# Altium schematic sheet Lights_Board_2.SchDoc: Lights 2
size Letter; Revision: 1.0; SheetNumber: 2; SheetTotal: 2; Website: www.uwmidsun.com; ProjectName: Lights Board
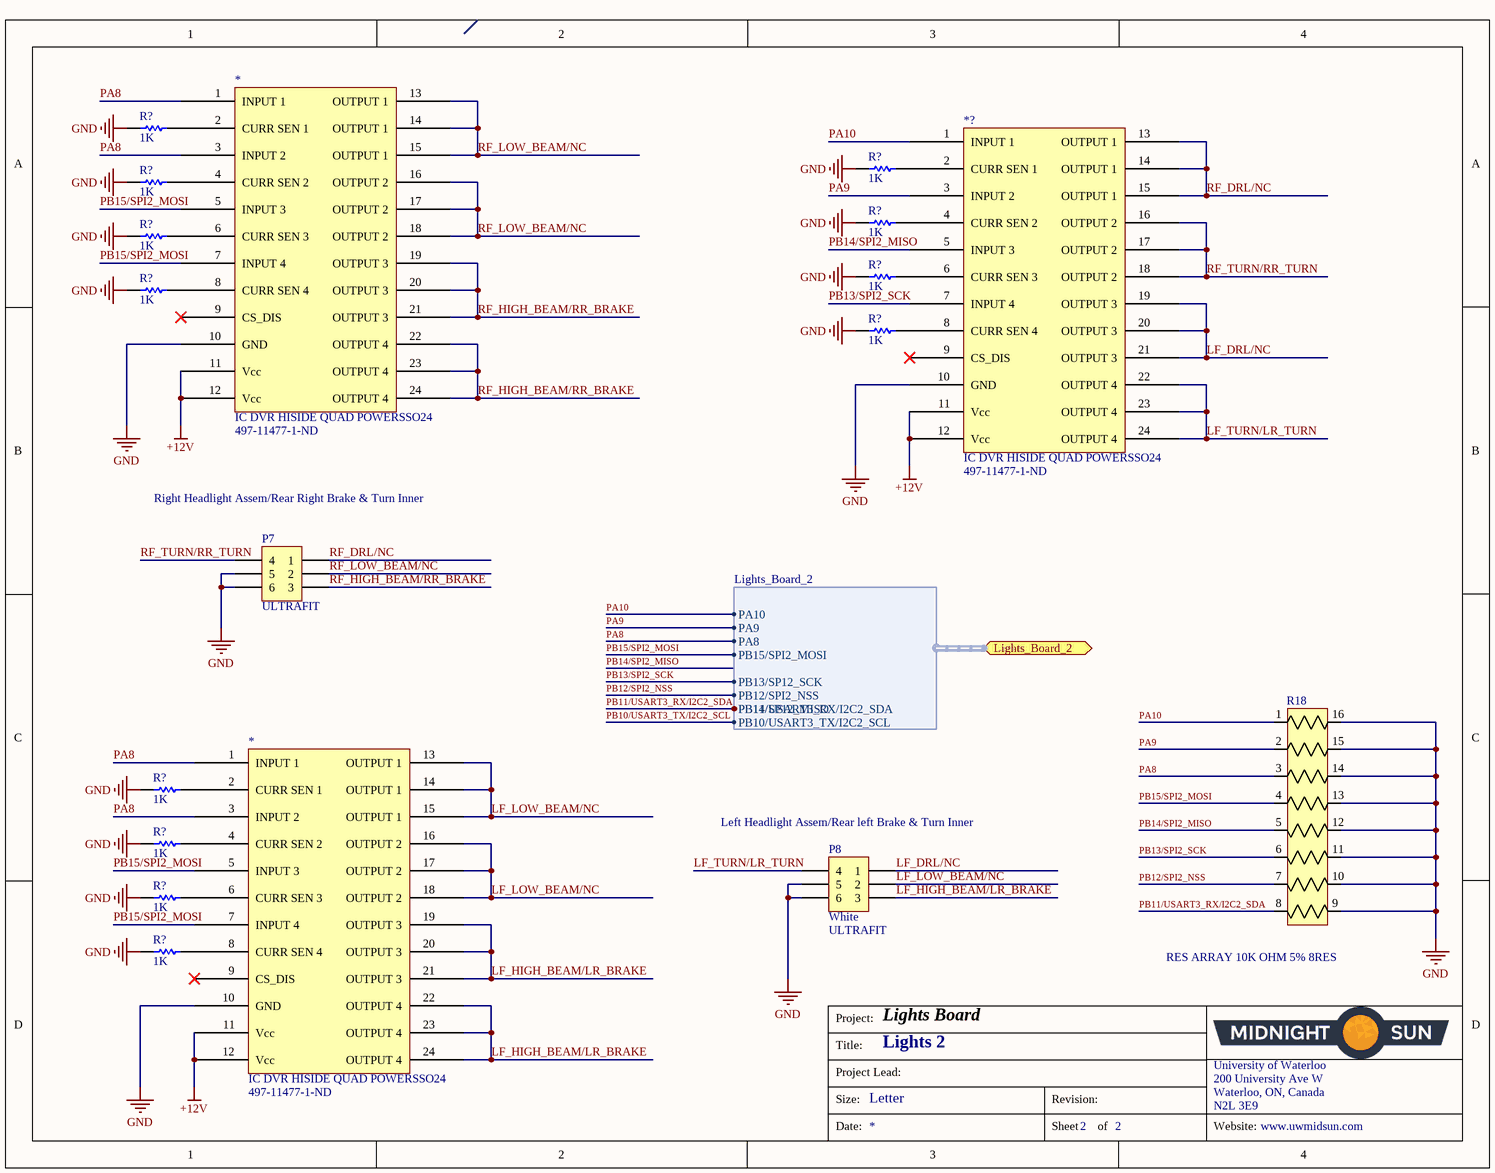
[diagram p0: Lights_Board_2.SchDoc]

## Parts
(Parts that share a designator on the sheet are numbered #1, #2 ... from top to bottom, then left to right.)
*#1  IC DVR HISIDE QUAD POWERSSO24  Supplier Part Number 1: 497-11477-1-ND  [IC DVR HISIDE QUAD POWERSSO24]
*#2  IC DVR HISIDE QUAD POWERSSO24  Supplier Part Number 1: 497-11477-1-ND  [IC DVR HISIDE QUAD POWERSSO24]
*?  IC DVR HISIDE QUAD POWERSSO24  Supplier Part Number 1: 497-11477-1-ND  [IC DVR HISIDE QUAD POWERSSO24]
P7  Series: ULTRAFIT  [CONN, 6POS ULTRA-FIT]  (hidden comment: CONN 6POS ULTRA-FIT 0.138")
P8  Insulation Color: White  Series: ULTRAFIT  [CONN, 6POS ULTRA-FIT - NATURAL COLOR]  (hidden comment: CONN 6POS ULTRA-FIT NATURAL COLOR 0.138")
R18  RES ARRAY 10K OHM 5% 8RES  [RES ARRAY, 8 POS 1506]
R?#1  1K  [RES, 0603]
R?#2  1K  [RES, 0603]
R?#3  1K  [RES, 0603]
R?#4  1K  [RES, 0603]
R?#5  1K  [RES, 0603]
R?#6  1K  [RES, 0603]
R?#7  1K  [RES, 0603]
R?#8  1K  [RES, 0603]
R?#9  1K  [RES, 0603]
R?#10  1K  [RES, 0603]
R?#11  1K  [RES, 0603]
R?#12  1K  [RES, 0603]

## Ports
Lights_Board_2 (harness Lights_Board_2)

## Harnesses
Lights_Board_2: PA10, PA9, PA8, PB15/SPI2_MOSI, PB14/SP12_MISO, PB13/SP12_SCK, PB12/SPI2_NSS, PB11/USART3_RX/I2C2_SDA, PB10/USART3_TX/I2C2_SCL

## Nets
+12V: *#1.11(Vcc) *#1.12(Vcc) *#2.11(Vcc) *#2.12(Vcc) *?.11(Vcc) *?.12(Vcc)
GND: *#1.10(GND) *#2.10(GND) *?.10(GND) P7.5 P7.6 P8.5 P8.6 R18.9 R18.10 R18.11 R18.12 R18.13 R18.14 R18.15 R18.16 R?#1.1 R?#2.1 R?#3.1 R?#4.1 R?#5.1 R?#6.1 R?#7.1 R?#8.1 R?#9.1 R?#10.1 R?#11.1 R?#12.1
LF_DRL/NC: *?.19(OUTPUT_3) *?.20(OUTPUT_3) *?.21(OUTPUT_3) P8.1
LF_HIGH_BEAM/LR_BRAKE: *#2.19(OUTPUT_3) *#2.20(OUTPUT_3) *#2.21(OUTPUT_3) *#2.22(OUTPUT_4) *#2.23(OUTPUT_4) *#2.24(OUTPUT_4) P8.3
LF_LOW_BEAM/NC: *#2.13(OUTPUT_1) *#2.14(OUTPUT_1) *#2.15(OUTPUT_1) *#2.16(OUTPUT_2) *#2.17(OUTPUT_2) *#2.18(OUTPUT_2) P8.2
LF_TURN/LR_TURN: *?.22(OUTPUT_4) *?.23(OUTPUT_4) *?.24(OUTPUT_4) P8.4
PA8: *#1.1(INPUT_1) *#1.3(INPUT_2) *#2.1(INPUT_1) *#2.3(INPUT_2) R18.3 ; port Lights_Board_2.PA8
PA9: *?.3(INPUT_2) R18.2 ; port Lights_Board_2.PA9
PA10: *?.1(INPUT_1) R18.1 ; port Lights_Board_2.PA10
PB10/USART3_TX/I2C2_SCL: port Lights_Board_2.PB10/USART3_TX/I2C2_SCL
PB11/USART3_RX/I2C2_SDA: R18.8 ; port Lights_Board_2.PB14/SP12_MISO, port Lights_Board_2.PB11/USART3_RX/I2C2_SDA
PB12/SPI2_NSS: R18.7 ; port Lights_Board_2.PB12/SPI2_NSS
PB13/SPI2_SCK: *?.7(INPUT_4) R18.6 ; port Lights_Board_2.PB13/SP12_SCK
PB14/SPI2_MISO: *?.5(INPUT_3) R18.5
PB15/SPI2_MOSI: *#1.5(INPUT_3) *#1.7(INPUT_4) *#2.5(INPUT_3) *#2.7(INPUT_4) R18.4 ; port Lights_Board_2.PB15/SPI2_MOSI
RF_DRL/NC: *?.13(OUTPUT_1) *?.14(OUTPUT_1) *?.15(OUTPUT_1) P7.1
RF_HIGH_BEAM/RR_BRAKE: *#1.19(OUTPUT_3) *#1.20(OUTPUT_3) *#1.21(OUTPUT_3) *#1.22(OUTPUT_4) *#1.23(OUTPUT_4) *#1.24(OUTPUT_4) P7.3
RF_LOW_BEAM/NC: *#1.13(OUTPUT_1) *#1.14(OUTPUT_1) *#1.15(OUTPUT_1) *#1.16(OUTPUT_2) *#1.17(OUTPUT_2) *#1.18(OUTPUT_2) P7.2
RF_TURN/RR_TURN: *?.16(OUTPUT_2) *?.17(OUTPUT_2) *?.18(OUTPUT_2) P7.4
Net*#1_2: *#1.2(CURR_SEN_1) R?#1.2
Net*#1_4: *#1.4(CURR_SEN_2) R?#3.2
Net*#1_6: *#1.6(CURR_SEN_3) R?#5.2
Net*#1_8: *#1.8(CURR_SEN_4) R?#7.2
Net*#2_2: *#2.2(CURR_SEN_1) R?#9.2
Net*#2_4: *#2.4(CURR_SEN_2) R?#10.2
Net*#2_6: *#2.6(CURR_SEN_3) R?#11.2
Net*#2_8: *#2.8(CURR_SEN_4) R?#12.2
Net*?_2: *?.2(CURR_SEN_1) R?#2.2
Net*?_4: *?.4(CURR_SEN_2) R?#4.2
Net*?_6: *?.6(CURR_SEN_3) R?#6.2
Net*?_8: *?.8(CURR_SEN_4) R?#8.2

Not connected (* = marked no-connect by the designer): *#1 9(CS_DIS)*; *#2 9(CS_DIS)*; *? 9(CS_DIS)*

## Notes on the sheet
- Right Headlight Assem/Rear Right Brake & Turn Inner
- (near P8) Left Headlight Assem/Rear left Brake & Turn Inner
- Project:
- Title:
- Size:
- Project Lead:
- Letter
- Revision:
- University of Waterloo
- 200 University Ave W
- Waterloo, ON, Canada
- N2L 3E9
- Date:
- Sheet
- of
- Website:

## Library data of the parts
*#1 *#2 *? = IC DVR HISIDE QUAD POWERSSO24: Manufacturer: STMicroelectronics; Manufacturer Part Number: VNQ5050AKTR-E; Switch Type: General Purpose; Number of Outputs: 4; Ratio - Input:Output: 1:1; Output Configuration: High Side; Output Type: N-Channel; Interface: On/Off; Voltage - Load: 4.5 V ~ 36 V; Voltage - Supply (Vcc/Vdd): Not Required; Current - Output (Max): 13.5A; Rds On (Typ): 50 mOhm (Max); Input Type: Non-Inverting; Fault Protection: Current Limiting (Fixed), Over Temperature, Over Voltage; Supplier 1: Digi-Key; RoHS: RoHS Compliant; Category: Integrated Circuits (ICs); Stock 1: 409; Pricing 1: 1=7.53, 10=6.765, 100=5.5429, 500=4.71858 (CAD); Packaging: Cut Tape (CT); Part Status: Active; Features: -; Operating Temperature: -40°C ~ 150°C (TJ); Package / Case: 24-SOP (0.295", 7.50mm Width) Exposed Pad; Supplier Device Package: PowerSSO-24; Base Part Number: VNQ5050; ComponentLink1URL: http://www.st.com/content/ccc/resource/technical/document/datasheet/ca/3e/7c/01/e8/ad/4c/de/CD00154145.pdf/files/CD00154145.pdf/jcr:content/translations/en.CD00154145.pdf; ComponentLink1Description: http://www.st.com/content/ccc/resource/technical/document/datasheet/ca/3e/7c/01/e8/ad/4c/de/CD00154145.pdf/files/CD00154145.pdf/jcr:content/translations/en.CD00154145.pdf
P7 = CONN 6POS ULTRA-FIT 0.138": 6 Positions Header Connector 0.138" (3.50mm) Through Hole Tin; Manufacturer 1: Molex, LLC; Manufacturer Part Number 1: 1722991106; Style: Board to Cable/Wire; Shrouding: Shrouded - 4 Wall; Number of Positions: 6; Number of Positions Loaded: All; Row Spacing - Mating: 0.181" (4.60mm); Contact Length - Post: 0.126" (3.20mm); Material Flammability Rating: UL94 V-0; Mated Stacking Heights: 26.99mm; Voltage: 400V; Supplier 1: Digi-Key; Supplier Part Number 1: WM11778-ND; Packaging: Tray; Part Status: Active; Connector Type: Header; Contact Type: Male Pin; Pitch - Mating: 0.138" (3.50mm); Number of Rows: 2; Mounting Type: Through Hole; Termination: Solder; Fastening Type: Latch Holder; Contact Length - Mating: -; Overall Contact Length: -; Insulation Height: 0.465" (11.80mm); Contact Shape: Square; Contact Finish - Mating: Tin; Contact Finish Thickness - Mating: 60µin (1.52µm); Contact Finish - Post: Tin; Contact Material: Copper Alloy; Insulation Material: Liquid Crystal Polymer (LCP); Operating Temperature: -40°C ~ 105°C; Ingress Protection: -; Insulation Color: Black; Current Rating: -; Contact Finish Thickness - Post: 60µin (1.52µm); ComponentLink1URL: http://www.molex.com/pdm_docs/sd/1722991106_sd.pdf; ComponentLink1Description: http://www.molex.com/pdm_docs/sd/1722991106_sd.pdf
P8 = CONN 6POS ULTRA-FIT NATURAL COLOR 0.138": 6 Positions Header Connector 0.138" (3.50mm) Through Hole Tin; Manufacturer 1: Molex, LLC; Manufacturer Part Number 1: 1722992106; Description 1: ULTRAFIT VERT TIN PLATED NAT; Style: Board to Cable/Wire; Shrouding: Shrouded - 4 Wall; Number of Positions: 6; Number of Positions Loaded: All; Row Spacing - Mating: 0.181" (4.60mm); Contact Length - Post: 0.126" (3.20mm); Material Flammability Rating: UL94 V-0; Voltage Rating: 400V; Mated Stacking Heights: 26.99mm; Supplier 1: Digi-Key; Supplier Part Number 1: WM11799-ND; RoHS: RoHS Compliant; Category: Connectors, Interconnects; Stock 1: 315; Pricing 1: 1=1.85, 10=1.617, 50=1.4586, 100=1.395, 250=1.26816, 500=1.14134, 1000=1.01453, 2500=0.91942, 5000=0.88771 (CAD); Packaging: Tray; Part Status: Active; Connector Type: Header; Contact Type: Male Pin; Pitch - Mating: 0.138" (3.50mm); Number of Rows: 2; Mounting Type: Through Hole; Termination: Solder; Fastening Type: Latch Holder; Contact Length - Mating: -; Overall Contact Length: -; Insulation Height: 0.465" (11.80mm); Contact Shape: Square; Contact Finish - Mating: Tin; Contact Finish Thickness - Mating: 60µin (1.52µm); Contact Finish - Post: Tin; Contact Material: Copper Alloy; Insulation Material: Liquid Crystal Polymer (LCP); Features: Board Guide, Solder Retention; Operating Temperature: -40°C ~ 105°C; Ingress Protection: -; Current Rating: -; Contact Finish Thickness - Post: 60µin (1.52µm); Applications: Automotive, General Purpose, Industrial, Lighting, Medical, Military, Telecommunications; ComponentLink1URL: http://www.molex.com/pdm_docs/sd/1722992106_sd.pdf; ComponentLink1Description: http://www.molex.com/pdm_docs/sd/1722992106_sd.pdf
R18 = RES ARRAY 10K OHM 5% 8RES EXB-2HV103JV: RES ARRAY SMD 10K 5% 62.5mW 1506; Manufacturer: Panasonic Electronic Components; Vendor: Panasonic; C: Copyright (C) 2015 Accelerated Designs. All rights reserved; Circuit Type: Isolated; Temperature Coefficient: ±200ppm/°C; Value: Value; Copyright: Copyright (C) 2015 Accelerated Designs. All rights reserved; Manufacturer_Part_Number: EXB-2HV103JV; Supplier 1: Digi-Key; Manufacturer Part Number: EXB-2HV103JV; RoHS: RoHS Compliant; Category: Resistors; Stock 1: 152779; Pricing 1: 1=0.43, 10=0.373, 25=0.2712, 50=0.1964, 100=0.1456, 250=0.11176, 500=0.08806, 1000=0.06096 (CAD); Packaging: Cut Tape (CT); Part Status: Active; Resistance (Ohms): 10k; Tolerance: ±5%; Power Per Element: 62.5mW; Operating Temperature: -55°C ~ 125°C; Applications: Automotive AEC-Q200; Mounting Type: Surface Mount; Package / Case: 1506, Convex, Long Side Terminals; Supplier Device Package: 1506; Size / Dimension: 0.150" L x 0.063" W (3.80mm x 1.60mm); Height - Seated (Max): 0.022" (0.55mm); ComponentLink1URL: https://industrial.panasonic.com/cdbs/www-data/pdf/AOC0000/AOC0000C14.pdf; ComponentLink1Description: https://industrial.panasonic.com/cdbs/www-data/pdf/AOC0000/AOC0000C14.pdf; Supplier Part Number 1: Y1103CT-ND
R?#1-R?#12 = RES 1K OHM 5% 1/10W 0603: 1k Ohm ±5% 0.1W, 1/10W Chip Resistor 0603 (1608 Metric); Manufacturer: Yageo; Manufacturer Part Number: RC0603JR-071KL; Temperature Coefficient: ±100ppm/°C; Supplier 1: Digi-Key; Supplier Part Number 1: 311-1.0KGRCT-ND; RoHS: RoHS Compliant; Category: Resistors; Stock 1: 4415240; Pricing 1: 1=0.15, 10=0.017, 100=0.0071, 1000=0.0032, 2500=0.00278 (CAD); Packaging: Cut Tape (CT); Part Status: Active; Resistance (Ohms): 1k; Tolerance: ±5%; Power (Watts): 0.1W, 1/10W; Composition: Thick Film; Features: Moisture Resistant; Operating Temperature: -55°C ~ 155°C; Package / Case: 0603 (1608 Metric); Supplier Device Package: 0603; Size / Dimension: 0.063" L x 0.031" W (1.60mm x 0.80mm); Height - Seated (Max): 0.022" (0.55mm); Failure Rate: -; ComponentLink1URL: http://www.yageo.com/documents/recent/PYu-RC_Group_51_RoHS_L_7.pdf; ComponentLink1Description: http://www.yageo.com/documents/recent/PYu-RC_Group_51_RoHS_L_7.pdf